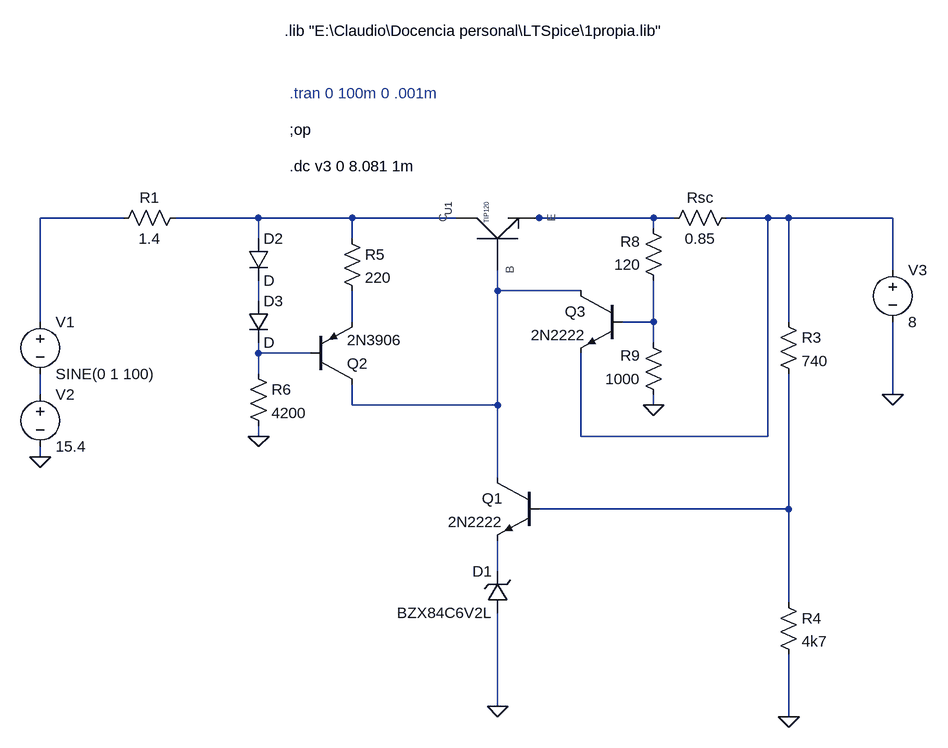
[diagram p0: schematic fuente clase 3_b.asc]
fuente clase 3_b.asc, the LTspice schematic file:
Version 4
SHEET 1 1288 1012
WIRE 16 224 -112 224
WIRE 224 224 96 224
WIRE 368 224 224 224
WIRE 528 224 368 224
WIRE 656 224 640 224
WIRE 832 224 656 224
WIRE 864 224 832 224
WIRE 1008 224 944 224
WIRE 1040 224 1008 224
WIRE 1200 224 1040 224
WIRE 832 240 832 224
WIRE 224 256 224 224
WIRE 368 256 368 224
WIRE 1200 304 1200 224
WIRE 592 336 592 304
WIRE 720 336 592 336
WIRE 224 352 224 320
WIRE -112 384 -112 224
WIRE 368 384 368 336
WIRE 832 384 832 320
WIRE 832 384 784 384
WIRE 1040 384 1040 224
WIRE 832 416 832 384
WIRE 224 432 224 416
WIRE 304 432 224 432
WIRE 224 464 224 432
WIRE -112 496 -112 464
WIRE 1200 496 1200 384
WIRE 368 512 368 480
WIRE 592 512 592 336
WIRE 592 512 368 512
WIRE 832 512 832 496
WIRE 224 560 224 544
WIRE 720 560 720 432
WIRE 1008 560 1008 224
WIRE 1008 560 720 560
WIRE -112 592 -112 576
WIRE 592 624 592 512
WIRE 1040 672 1040 464
WIRE 1040 672 656 672
WIRE 592 768 592 720
WIRE 1040 816 1040 672
WIRE 592 976 592 832
WIRE 1040 992 1040 896
FLAG 592 976 0
FLAG -112 592 0
FLAG 1200 496 0
FLAG 1040 992 0
FLAG 224 560 0
FLAG 832 512 0
DATAFLAG 592 336 ""
DATAFLAG -80 224 ""
DATAFLAG 368 352 ""
DATAFLAG 848 672 ""
SYMBOL Propia\\Darlington\ npn 592 256 R270
SYMATTR Value TIP120
SYMATTR InstName U1
SYMBOL zener 608 832 R180
WINDOW 0 24 64 Left 2
WINDOW 3 24 0 Left 2
SYMATTR InstName D1
SYMATTR Value BZX84C6V2L
SYMBOL voltage -112 368 R0
WINDOW 123 0 0 Left 0
WINDOW 39 0 0 Left 0
SYMATTR InstName V1
SYMATTR Value SINE(0 1 100)
SYMBOL voltage -112 480 R0
WINDOW 123 0 0 Left 0
WINDOW 39 0 0 Left 0
SYMATTR InstName V2
SYMATTR Value 15.4
SYMBOL res 112 208 R90
WINDOW 0 0 56 VBottom 2
WINDOW 3 32 56 VTop 2
SYMATTR InstName R1
SYMATTR Value 1.4
SYMBOL npn 656 624 M0
SYMATTR InstName Q1
SYMATTR Value 2N2222
SYMBOL res 1024 368 R0
SYMATTR InstName R3
SYMATTR Value 740
SYMBOL res 1024 800 R0
SYMATTR InstName R4
SYMATTR Value 4k7
SYMBOL pnp 304 480 M180
SYMATTR InstName Q2
SYMATTR Value 2N3906
SYMBOL res 352 240 R0
SYMATTR InstName R5
SYMATTR Value 220
SYMBOL diode 208 256 R0
SYMATTR InstName D2
SYMBOL diode 208 352 R0
SYMATTR InstName D3
SYMBOL res 208 448 R0
SYMATTR InstName R6
SYMATTR Value 4200
SYMBOL npn 784 336 M0
SYMATTR InstName Q3
SYMATTR Value 2N2222
SYMBOL res 960 208 R90
WINDOW 0 0 56 VBottom 2
WINDOW 3 32 56 VTop 2
SYMATTR InstName Rsc
SYMATTR Value 0.85
SYMBOL res 848 336 R180
WINDOW 0 36 76 Left 2
WINDOW 3 36 40 Left 2
SYMATTR InstName R8
SYMATTR Value 120
SYMBOL res 848 512 R180
WINDOW 0 36 76 Left 2
WINDOW 3 36 40 Left 2
SYMATTR InstName R9
SYMATTR Value 1000
SYMBOL voltage 1200 288 R0
WINDOW 123 0 0 Left 0
WINDOW 39 0 0 Left 0
SYMATTR InstName V3
SYMATTR Value 8
TEXT 272 32 Left 2 ;.tran 0 100m 0 .001m
TEXT 264 -64 Left 2 !.lib "E:\\Claudio\\Docencia personal\\LTSpice\\1propia.lib"
TEXT 272 88 Left 2 !;op
TEXT 272 144 Left 2 !.dc v3 0 8.081 1m

The netlist it stands for:
* fuente clase 3_b.asc
XU1 N002 N005 N003 TIP120  ; pins C B E
D1 0 N012 BZX84C6V2L
V1 N001 N010 SINE(0 1 100)
V2 N010 0 15.4
R1 N002 N001 1.4
Q1 N005 N011 N012 0 2N2222
R3 N004 N011 740
R4 N011 0 4k7
Q2 N005 N009 N007 0 2N3906
R5 N002 N007 220
D2 N002 N006 D
D3 N006 N009 D
R6 N009 0 4200
Q3 N005 N008 N004 0 2N2222
Rsc N004 N003 0.85
R8 N008 N003 120
R9 0 N008 1000
V3 N004 0 8
.model D D
.lib standard.dio
.model NPN NPN
.model PNP PNP
.lib standard.bjt
* .tran 0 100m 0 .001m
.lib "E:\Claudio\Docencia personal\LTSpice\1propia.lib"
;op
.dc v3 0 8.081 1m
.backanno
.end